# EAGLE schematic BLL-EBOOK-3506 (EAGLE 9.6.2)
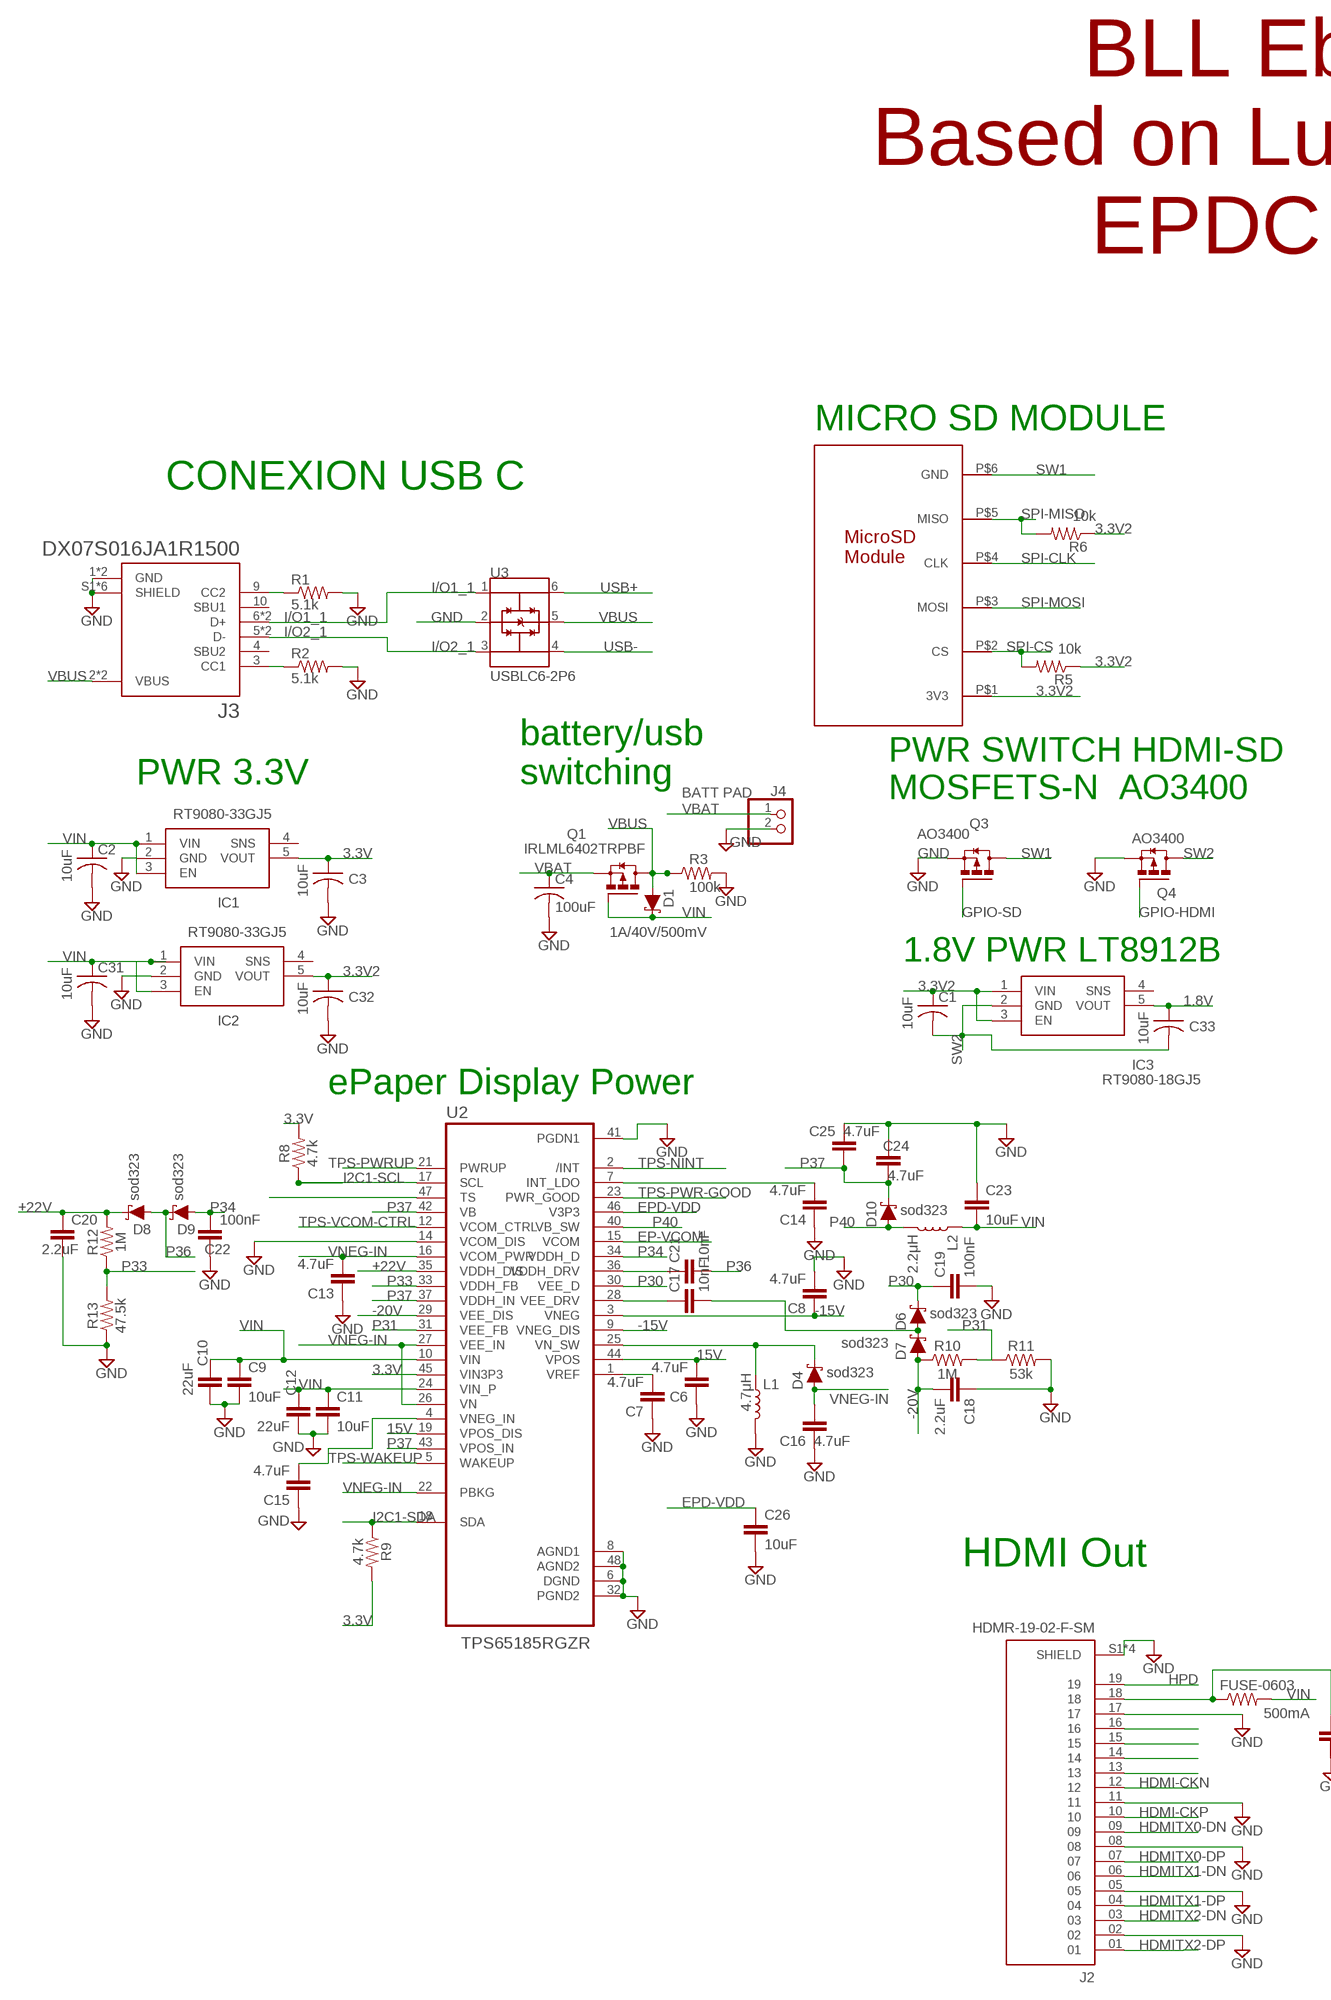
[diagram p0: schematic, sheet 1, part 1 of 2]
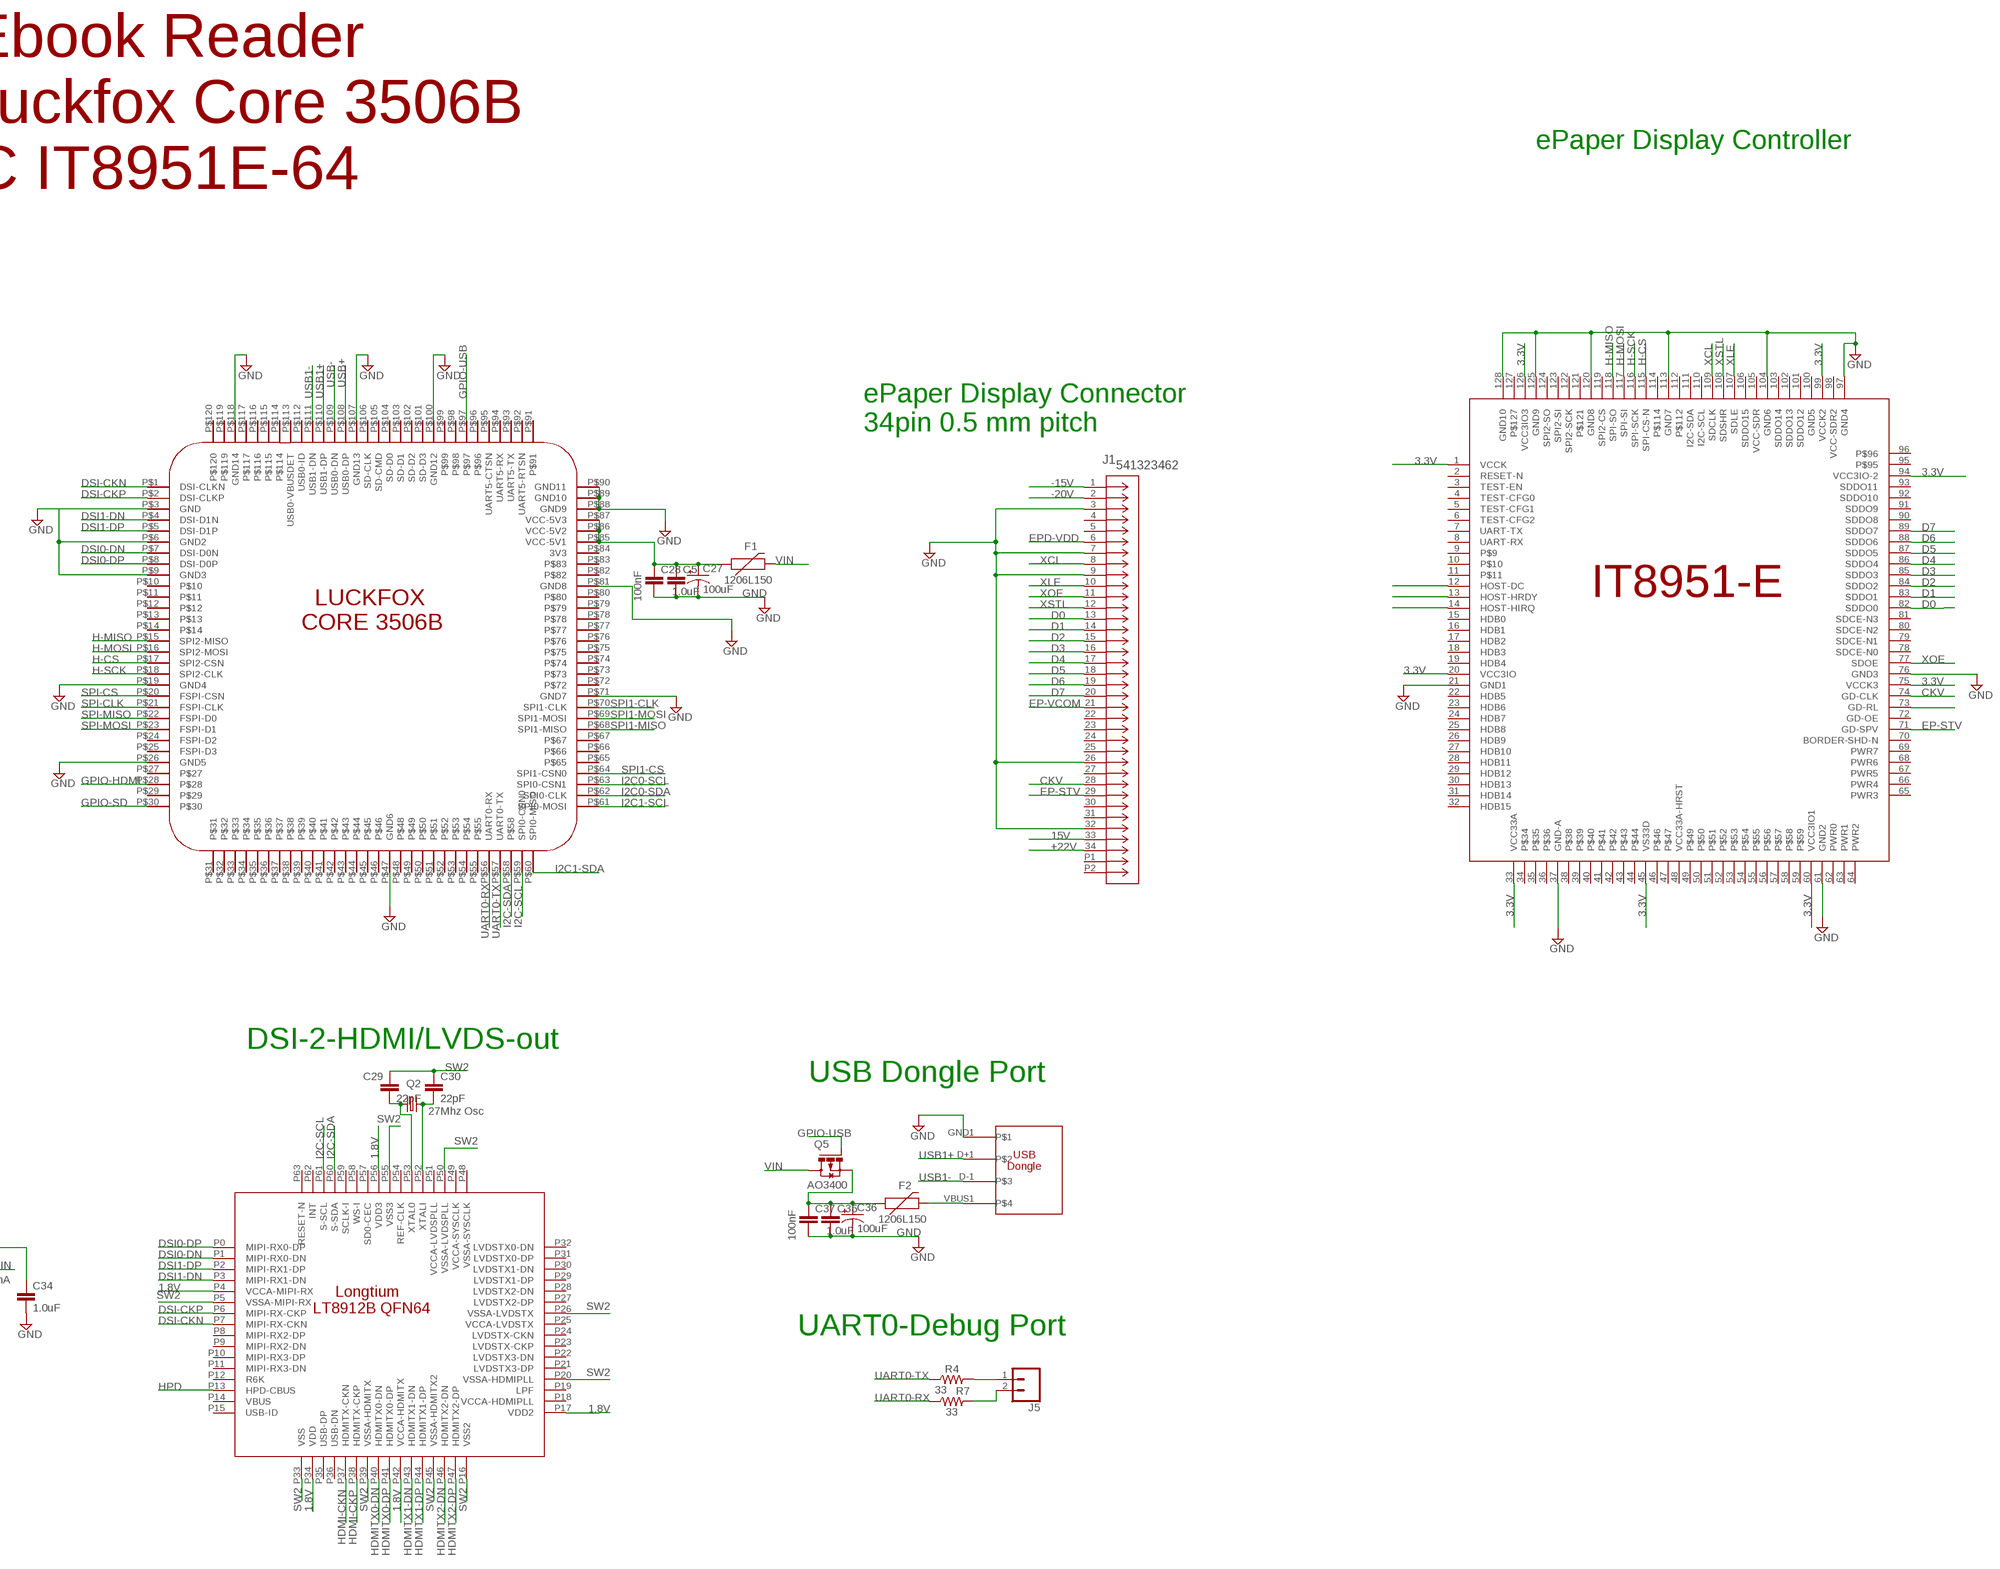
[diagram p1: schematic, sheet 1, part 2 of 2]

## Parts
C1  10uF  C-USC0603  [C0603]
C2  10uF  C-USC0603  [C0603]
C3  10uF  C-USC0603  [C0603]
C4  100uF  C-USC0603  [C0603]
C5  1.0uF  1.0UF-0603-16V-10%-X7R  [0603]
C6  4.7uF  4.7UF-0603-35V-(20%)  [0603]
C7  4.7uF  4.7UF-0603-35V-(20%)  [0603]
C8  4.7uF  4.7UF-0603-35V-(20%)  [0603]
C9  10uF  10UF-0805-10V-10%  [0805]
C10  22uF  22UF-0805-16V-20%  [0805]
C11  10uF  10UF-0805-10V-10%  [0805]
C12  22uF  22UF-0805-16V-20%  [0805]
C13  4.7uF  4.7UF-0603-35V-(20%)  [0603]
C14  4.7uF  4.7UF-0603-35V-(20%)  [0603]
C15  4.7uF  4.7UF-0603-35V-(20%)  [0603]
C16  4.7uF  4.7UF-0603-35V-(20%)  [0603]
C17  10nF  10NF-0603-50V-10%  [0603]
C18  2.2uF  2.2UF-1206-50V-10%  [1206]
C19  100nF  DNP-0603  [0603]
C20  2.2uF  2.2UF-1206-50V-10%  [1206]
C21  10nF  10NF-0603-50V-10%  [0603]
C22  100nF  DNP-0603  [0603]
C23  10uF  10UF-0805-10V-10%  [0805]
C24  4.7uF  4.7UF-0603-35V-(20%)  [0603]
C25  4.7uF  4.7UF-0603-35V-(20%)  [0603]
C26  10uF  10UF-0805-10V-10%  [0805]
C27  100uF  100UF-POLAR-EIA3528-10V-20%(TANT)  [EIA3528]
C28  100nF  CAP-0805  [0805]
C29  22pF  22PF-0603-50V-5%  [0603]
C30  22pF  22PF-0603-50V-5%  [0603]
C31  10uF  C-USC0603  [C0603]
C32  10uF  C-USC0603  [C0603]
C33  10uF  C-USC0603  [C0603]
C34  1.0uF  1.0UF-0603-16V-10%  [0603]
C35  1.0uF  1.0UF-0603-16V-10%-X7R  [0603]
C36  100uF  100UF-POLAR-EIA3528-10V-20%(TANT)  [EIA3528]
C37  100nF  CAP-0805  [0805]
D1  1A/40V/500mV  DIODE-SCHOTTKY-SS14  [SMA-DIODE]
D4  sod323  DIODE-SCHOTTKY-PMEG4005EJ  [SOD-323]
D6  sod323  DIODE-SCHOTTKY-PMEG4005EJ  [SOD-323]
D7  sod323  DIODE-SCHOTTKY-PMEG4005EJ  [SOD-323]
D8  sod323  DIODE-SCHOTTKY-PMEG4005EJ  [SOD-323]
D9  sod323  DIODE-SCHOTTKY-PMEG4005EJ  [SOD-323]
D10  sod323  DIODE-SCHOTTKY-PMEG4005EJ  [SOD-323]
F1  1206L150  PPTC_6V500MA-2  [1206]
F2  1206L150  PPTC_6V500MA-2  [1206]
FUSE-0603  500mA  1.8MOHM  [0603]
IC1  RT9080-33GJ5  [SOT94P280X100-5N]
IC2  RT9080-33GJ5  [SOT94P280X100-5N]
IC3  RT9080-18GJ5  RT9080-33GJ5  [SOT94P280X100-5N]
J1  541323462  [CON_541323462_MOL]
J2  HDMR-19-02-F-SM  [SAMTEC_HDMR-19-02-F-SM]
J3  DX07S016JA1R1500  [JAE_DX07S016JA1R1500]
J4  BATT PAD  PINHD-1X2/90  [1X02/90]
J5  CONN_02LOCK  [1X02_LOCK]
L1  4.7μH  4.7μH_SHIELDED_INDUCTOR  [1008(2520)]
L2  2.2μH  2.2μH_SHIELDED_INDUCTOR  [0806]
LT8912  LT8912B  [LT8912B]
Q1  IRLML6402TRPBF  [SOT23]
Q2  27Mhz Osc  KX-9B  [5.0X3.2_2]
Q3  AO3400  IRLML6402TRPBF  [SOT23]
Q4  AO3400  IRLML6402TRPBF  [SOT23]
Q5  AO3400  IRLML6402TRPBF  [SOT23]
R1  5.1k  R-US_M0805  [M0805]
R2  5.1k  R-US_M0805  [M0805]
R3  100k  R-US_R0603  [R0603]
R4  33  33OHM-0603-1/10W-1%  [0603]
R5  10k  R-US_M0805  [M0805]
R6  10k  R-US_M0805  [M0805]
R7  33  33OHM-0603-1/10W-1%  [0603]
R8  4.7k  4.7KOHM-0603-1/10W-1%  [0603]
R9  4.7k  4.7KOHM-0603-1/10W-1%  [0603]
R10  1M  1MOHM-0603-1/4W-5%  [0603]
R11  53k  RESISTOR0805  [0805]
R12  1M  1MOHM-0603-1/4W-5%  [0603]
R13  47.5k  RESISTOR0805  [0805]
U2  TPS65185RGZR  [QFN50P700X700X100-49N]
U3  USBLC6-2P6  [SOT50P160X60-6N]
U$1  IT8951  [LQFP128_STM]
U$3  LUCKFOX_CORE3506  [CORE3506]
U$4  MICROSD-MODULE  [MICROSD-MOD]
U$5  USB-WIFI-DONGLE  [USB-A-SMT-MALE]

## Nets
1.8V: C33.1 IC3.5(VOUT) LT8912.P4(VCCA-MIPI-RX) LT8912.P17(VDD2) LT8912.P34(VDD) LT8912.P42(VCCA-HDMITX) LT8912.P56(VDD3)
3.3V: C3.1 IC1.5(VOUT) R8.2 R9.2 U2.45(VIN3P3) U$1.1(VCCK) U$1.20(VCC3IO) U$1.33(VCC33A) U$1.45(VS33D) U$1.60(VCC3IO1) U$1.75(VCCK3) U$1.94(VCC3IO-2) U$1.99(VCCK2) U$1.126(VCC3IO3)
3.3V2: C1.1 C32.1 IC2.5(VOUT) IC3.1(VIN) IC3.3(EN) R5.1 R6.1 U$4.P$1(3V3)
15V: C6.2 J1.33 U2.19(VPOS_DIS) U2.44(VPOS)
+22V: C20.1 D8.C J1.34 R12.2 U2.35(VDDH_DIS)
-15V: C8.1 J1.1 U2.3(VNEG) U2.9(VNEG_DIS)
-20V: C18.2 D7.A J1.2 R10.1 U2.29(VEE_DIS)
CKV: J1.28 U$1.74(GD-CLK)
D0: J1.13 U$1.82(SDDO0)
D1: J1.14 U$1.83(SDDO1)
D2: J1.15 U$1.84(SDDO2)
D3: J1.16 U$1.85(SDDO3)
D4: J1.17 U$1.86(SDDO4)
D5: J1.18 U$1.87(SDDO5)
D6: J1.19 U$1.88(SDDO6)
D7: J1.20 U$1.89(SDDO7)
DSI0-DN: LT8912.P1(MIPI-RX0-DN) U$3.P$7(DSI-D0N)
DSI0-DP: LT8912.P0(MIPI-RX0-DP) U$3.P$8(DSI-D0P)
DSI1-DN: LT8912.P3(MIPI-RX1-DN) U$3.P$4(DSI-D1N)
DSI1-DP: LT8912.P2(MIPI-RX1-DP) U$3.P$5(DSI-D1P)
DSI-CKN: LT8912.P7(MIPI-RX-CKN) U$3.P$1(DSI-CLKN)
DSI-CKP: LT8912.P6(MIPI-RX-CKP) U$3.P$2(DSI-CLKP)
EP-STV: J1.29 U$1.71(GD-SPV)
EP-VCOM: J1.21 U2.15(VCOM)
EPD-VDD: C26.1 J1.6 U2.46(V3P3)
GND: C2.2 C3.2 C4.2 C5.2 C6.1 C7.1 C8.2 C9.2 C10.2 C11.2 C12.2 C13.1 C14.1 C15.1 C16.1 C18.1 C19.2 C20.2 C22.1 C23.1 C24.2 C25.2 C26.2 C27.C(-) C28.2 C31.2 C32.2 C34.2 C35.2 C36.C(-) C37.2 IC1.2(GND) IC2.2(GND) J1.3 J1.7 J1.9 J1.26 J1.32 J2.02 J2.05 J2.08 J2.11 J2.17 J2.S1(SHIELD) J2.S2(SHIELD) J2.S3(SHIELD) J2.S4(SHIELD) J3.1(GND) J3.12(GND) J3.S1(SHIELD) J3.S2(SHIELD) J3.S3(SHIELD) J3.S4(SHIELD) J3.S5(SHIELD) J3.S6(SHIELD) J4.2 L1.2 Q3.2(S) Q4.2(S) R1.2 R2.2 R3.2 R11.2 R13.1 U2.6(DGND) U2.8(AGND1) U2.14(VCOM_DIS) U2.32(PGND2) U2.41(PGDN1) U2.48(AGND2) U3.2(GND) U$1.21(GND1) U$1.37(GND-A) U$1.61(GND2) U$1.76(GND3) U$1.97(GND4) U$1.104(GND6) U$1.113(GND7) U$1.120(GND8) U$1.125(GND9) U$1.128(GND10) U$3.P$3(GND) U$3.P$6(GND2) U$3.P$9(GND3) U$3.P$19(GND4) U$3.P$26(GND5) U$3.P$47(GND6) U$3.P$71(GND7) U$3.P$81(GND8) U$3.P$88(GND9) U$3.P$89(GND10) U$3.P$90(GND11) U$3.P$100(GND12) U$3.P$107(GND13) U$3.P$118(GND14) U$5.GND1
GPIO-HDMI: Q4.1(G) U$3.P$28
GPIO-SD: Q3.1(G) U$3.P$30
GPIO-USB: Q5.1(G) U$3.P$97
H-CS: U$1.115(SPI-CS-N) U$3.P$17(SPI2-CSN)
H-MISO: U$1.118(SPI-SO) U$3.P$15(SPI2-MISO)
H-MOSI: U$1.117(SPI-SI) U$3.P$16(SPI2-MOSI)
H-SCK: U$1.116(SPI-SCK) U$3.P$18(SPI2-CLK)
HDMI-CKN: J2.12 LT8912.P37(HDMITX-CKN)
HDMI-CKP: J2.10 LT8912.P38(HDMITX-CKP)
HDMITX0-DN: J2.09 LT8912.P40(HDMITX0-DN)
HDMITX0-DP: J2.07 LT8912.P41(HDMITX0-DP)
HDMITX1-DN: J2.06 LT8912.P43(HDMITX1-DN)
HDMITX1-DP: J2.04 LT8912.P44(HDMITX1-DP)
HDMITX2-DN: J2.03 LT8912.P46(HDMITX2-DN)
HDMITX2-DP: J2.01 LT8912.P47(HDMITX2-DP)
HPD: J2.19 LT8912.P13(HPD-CBUS)
I2C0-SCL: U$3.P$63(SPI0-CSN1)
I2C0-SDA: U$3.P$62(SPI0-CLK)
I2C1-SCL: R8.1 U2.17(SCL) U$3.P$61(SPI0-MOSI)
I2C1-SDA: R9.1 U2.18(SDA) U$3.P$60(SPI0-MISO)
I2C-SCL: LT8912.P61(S-SCL) U$3.P$59(SPI0-CSN0)
I2C-SDA: LT8912.P60(S-SDA) U$3.P$58
I/O1_1: J3.6(D+) J3.7(D+) U3.1(I/O1_1)
I/O2_1: J3.5(D-) J3.8(D-) U3.3(I/O2_1)
N$1: C29.2 LT8912.P53(XTAL0) Q2.1
N$2: C30.2 LT8912.P52(XTALI) Q2.2
N$3: J3.3(CC1) R2.1
N$4: J3.9(CC2) R1.1
N$5: F2.2 U$5.VBUS1
N$6: J5.1 R4.2
N$7: U$1.73(GD-RL)
N$8: U$1.12(HOST-DC)
N$9: J5.2 R7.2
N$10: U$1.13(HOST-HRDY)
N$11: U2.47(TS)
N$12: C7.2 U2.1(VREF)
N$13: C15.2 U2.4(VNEG_IN)
N$14: C14.2 U2.7(INT_LDO)
N$15: D4.C L1.1 U2.25(VN_SW)
N$16: C17.1 U2.28(VEE_DRV)
N$17: C17.2 D6.A D7.C
N$19: C21.1 U2.36(VDDH_DRV)
N$22: U$1.14(HOST-HIRQ)
N$30: J2.13
N$31: J2.14
N$32: J2.15
N$33: J2.16
N$35: C34.1 FUSE-0603.1 J2.18
P: C5.1 C27.A(+) C28.1 F1.1 U$3.P$85(VCC-5V1) U$3.P$86(VCC-5V2) U$3.P$87(VCC-5V3)
P1: C35.1 C36.A(+) C37.1 F2.1 Q5.2(S)
P30: C19.1 D6.C U2.30(VEE_D)
P31: R10.2 R11.1 U2.31(VEE_FB)
P33: R12.1 R13.2 U2.33(VDDH_FB)
P34: C22.2 D9.A U2.34(VDDH_D)
P36: C21.2 D8.A D9.C
P37: C24.1 C25.1 D10.C U2.37(VDDH_IN) U2.42(VB) U2.43(VPOS_IN)
P40: D10.A L2.2 U2.40(VB_SW)
SPI1-CLK: U$3.P$70(SPI1-CLK)
SPI1-CS: U$3.P$64(SPI1-CSN0)
SPI1-MISO: U$3.P$68(SPI1-MISO)
SPI1-MOSI: U$3.P$69(SPI1-MOSI)
SPI-CLK: U$3.P$21(FSPI-CLK) U$4.P$4(CLK)
SPI-CS: R5.2 U$3.P$20(FSPI-CSN) U$4.P$2(CS)
SPI-MISO: R6.2 U$3.P$22(FSPI-D0) U$4.P$5(MISO)
SPI-MOSI: U$3.P$23(FSPI-D1) U$4.P$3(MOSI)
SW1: Q3.3(D) U$4.P$6(GND)
SW2: C1.2 C29.1 C30.1 C33.2 IC3.2(GND) LT8912.P5(VSSA-MIPI-RX) LT8912.P16(VSS2) LT8912.P20(VSSA-HDMIPLL) LT8912.P26(VSSA-LVDSTX) LT8912.P33(VSS) LT8912.P39(VSSA-HDMITX) LT8912.P45(VSSA-HDMITX2) LT8912.P50(VSSA-LVDSPLL) LT8912.P55(VSS3) Q4.3(D)
TPS-NINT: U2.2(/INT)
TPS-PWR-GOOD: U2.23(PWR_GOOD)
TPS-PWRUP: U2.21(PWRUP)
TPS-VCOM-CTRL: U2.12(VCOM_CTRL)
TPS-WAKEUP: U2.5(WAKEUP)
UART0-RX: R7.1 U$3.P$56(UART0-RX)
UART0-TX: R4.1 U$3.P$57(UART0-TX)
USB1+: U$3.P$110(USB1-DP) U$5.D+1
USB1-: U$3.P$111(USB1-DN) U$5.D-1
USB+: U3.6(I/O1_2) U$3.P$108(USB0-DP)
USB-: U3.4(I/O2_2) U$3.P$109(USB0-DN)
VBAT: C4.1 J4.1 Q1.2(S)
VBUS: D1.A J3.2(VBUS) J3.11(VBUS) Q1.3(D) R3.1 U3.5(VBUS)
VIN: C2.1 C9.1 C10.1 C11.1 C12.1 C23.2 C31.1 D1.C F1.2 FUSE-0603.2 IC1.1(VIN) IC1.3(EN) IC2.1(VIN) IC2.3(EN) L2.1 Q1.1(G) Q5.3(D) U2.10(VIN) U2.24(VIN_P)
VNEG-IN: C13.2 C16.2 D4.A U2.16(VCOM_PWR) U2.22(PBKG) U2.26(VN) U2.27(VEE_IN)
XCL: J1.8 U$1.109(SDCLK)
XLE: J1.10 U$1.107(SDLE)
XOE: J1.11 U$1.77(SDOE)
XSTL: J1.12 U$1.108(SDSHR)
Unconnected: IC1.4(SNS) IC2.4(SNS) IC3.4(SNS) J1.4 J1.5 J1.22 J1.23 J1.24 J1.25 J1.27 J1.30 J1.31 J1.P1 J1.P2 J3.4(SBU2) J3.10(SBU1) LT8912.P8(MIPI-RX2-DP) LT8912.P9(MIPI-RX2-DN) LT8912.P10(MIPI-RX3-DP) LT8912.P11(MIPI-RX3-DN) LT8912.P12(R6K) LT8912.P14(VBUS) LT8912.P15(USB-ID) LT8912.P18(VCCA-HDMIPLL) LT8912.P19(LPF) LT8912.P21(LVDSTX3-DP) LT8912.P22(LVDSTX3-DN) LT8912.P23(LVDSTX-CKP) LT8912.P24(LVDSTX-CKN) LT8912.P25(VCCA-LVDSTX) LT8912.P27(LVDSTX2-DP) LT8912.P28(LVDSTX2-DN) LT8912.P29(LVDSTX1-DP) LT8912.P30(LVDSTX1-DN) LT8912.P31(LVDSTX0-DP) LT8912.P32(LVDSTX0-DN) LT8912.P35(USB-DP) LT8912.P36(USB-DN) LT8912.P48(VSSA-SYSCLK) LT8912.P49(VCCA-SYSCLK) LT8912.P51(VCCA-LVDSPLL) LT8912.P54(REF-CLK) LT8912.P57(SD0-CEC) LT8912.P58(WS-I) LT8912.P59(SCLK-I) LT8912.P62(INT) LT8912.P63(RESET-N) U$1.2(RESET-N) U$1.3(TEST-EN) U$1.4(TEST-CFG0) U$1.5(TEST-CFG1) U$1.6(TEST-CFG2) U$1.7(UART-TX) U$1.8(UART-RX) U$1.9 U$1.10 U$1.11 U$1.15(HDB0) U$1.16(HDB1) U$1.17(HDB2) U$1.18(HDB3) U$1.19(HDB4) U$1.22(HDB5) U$1.23(HDB6) U$1.24(HDB7) U$1.25(HDB8) U$1.26(HDB9) U$1.27(HDB10) U$1.28(HDB11) U$1.29(HDB12) U$1.30(HDB13) U$1.31(HDB14) U$1.32(HDB15) U$1.34 U$1.35 U$1.36 U$1.38 U$1.39 U$1.40 U$1.41 U$1.42 U$1.43 U$1.44 U$1.46 U$1.47 U$1.48(VCC33A-HRST) U$1.49 U$1.50 U$1.51 U$1.52 U$1.53 U$1.54 U$1.55 U$1.56 U$1.57 U$1.58 U$1.59 U$1.62(PWR0) U$1.63(PWR1) U$1.64(PWR2) U$1.65(PWR3) U$1.66(PWR4) U$1.67(PWR5) U$1.68(PWR6) U$1.69(PWR7) U$1.70(BORDER-SHD-N) U$1.72(GD-OE) U$1.78(SDCE-N0) U$1.79(SDCE-N1) U$1.80(SDCE-N2) U$1.81(SDCE-N3) U$1.90(SDDO8) U$1.91(SDDO9) U$1.92(SDDO10) U$1.93(SDDO11) U$1.95 U$1.96 U$1.98(VCC-SDR2) U$1.100(GND5) U$1.101(SDDO12) U$1.102(SDDO13) U$1.103(SDDO14) U$1.105(VCC-SDR) U$1.106(SDDO15) U$1.110(I2C-SCL) U$1.111(I2C-SDA) U$1.112 U$1.114 U$1.119(SPI2-CS) U$1.121 U$1.122(SPI2-SCK) U$1.123(SPI2-SI) U$1.124(SPI2-SO) U$1.127 U$3.P$10 U$3.P$11 U$3.P$12 U$3.P$13 U$3.P$14 U$3.P$24(FSPI-D2) U$3.P$25(FSPI-D3) U$3.P$27 U$3.P$29 U$3.P$31 U$3.P$32 U$3.P$33 U$3.P$34 U$3.P$35 U$3.P$36 U$3.P$37 U$3.P$38 U$3.P$39 U$3.P$40 U$3.P$41 U$3.P$42 U$3.P$43 U$3.P$44 U$3.P$45 U$3.P$46 U$3.P$48 U$3.P$49 U$3.P$50 U$3.P$51 U$3.P$52 U$3.P$53 U$3.P$54 U$3.P$55 U$3.P$65 U$3.P$66 U$3.P$67 U$3.P$72 U$3.P$73 U$3.P$74 U$3.P$75 U$3.P$76 U$3.P$77 U$3.P$78 U$3.P$79 U$3.P$80 U$3.P$82 U$3.P$83 U$3.P$84(3V3) U$3.P$91 U$3.P$92(UART5-RTSN) U$3.P$93(UART5-TX) U$3.P$94(UART5-RX) U$3.P$95(UART5-CTSN) U$3.P$96 U$3.P$98 U$3.P$99 U$3.P$101(SD-D3) U$3.P$102(SD-D2) U$3.P$103(SD-D1) U$3.P$104(SD-D0) U$3.P$105(SD-CMD) U$3.P$106(SD-CLK) U$3.P$112(USB0-ID) U$3.P$113(USB0-VBUSDET) U$3.P$114 U$3.P$115 U$3.P$116 U$3.P$117 U$3.P$119 U$3.P$120

## Notes on the sheet
- ePaper Display Controller
- BLL Ebook Reader
  Based on Luckfox Core 3506B
  EPDC IT8951E-64
- MICRO SD MODULE
- CONEXION USB C
- ePaper Display Connector
  34pin 0.5 mm pitch
- PWR 3.3V
- battery/usb 
  switching
- PWR SWITCH HDMI-SD 
  MOSFETS-N  AO3400
- 1.8V PWR LT8912B
- ePaper Display Power
- DSI-2-HDMI/LVDS-out
- USB Dongle Port
- HDMI Out
- UART0-Debug Port

## Library data of the parts
C1-C4 C31-C33 = rcl:C-US: CAPACITOR, American symbol; SPICEPREFIX: C
C5 C35 = SparkFun-Capacitors:1.0UF: 1µF ceramic capacitors A capacitor is a passive two-terminal electrical component used to store electrical energy temporarily in an electric field.; PROD_ID: CAP-13930
C6-C8 C13-C16 C24 C25 = SparkFun-Capacitors:4.7UF: 4.7µF ceramic capacitors A capacitor is a passive two-terminal electrical component used to store electrical energy temporarily in an electric field.; PROD_ID: CAP-14106
C9 C11 C23 C26 = SparkFun-Capacitors:10UF: 10.0µF ceramic capacitors A capacitor is a passive two-terminal electrical component used to store electrical energy temporarily in an electric field.; PROD_ID: CAP-11330
C10 C12 = SparkFun-Capacitors:22UF: 22µF ceramic capacitors A capacitor is a passive two-terminal electrical component used to store electrical energy temporarily in an electric field.; PROD_ID: CAP-14260
C17 C21 = SparkFun-Capacitors:10NF: 0.01uF/10nF/10,000pF ceramic capacitors A capacitor is a passive two-terminal electrical component used to store electrical energy temporarily in an electric field. CAP-09321; PROD_ID: CAP-00867
C18 C20 = SparkFun-Capacitors:2.2UF: 2.2µF ceramic capacitors A capacitor is a passive two-terminal electrical component used to store electrical energy temporarily in an electric field.; PROD_ID: CAP-10009
C19 C22 = SparkFun-Capacitors:DNP: Do-Not-Populate capacitor; VALUE: DNP
C27 C36 = SparkFun-Capacitors:100UF-POLAR: 100µF polarized capacitors A capacitor is a passive two-terminal electrical component used to store electrical energy temporarily in an electric field.; PROD_ID: CAP-16823
C28 C37 = SparkFun-Capacitors:CAP
C29 C30 = SparkFun-Capacitors:22PF: 22pF ceramic capacitors A capacitor is a passive two-terminal electrical component used to store electrical energy temporarily in an electric field.; PROD_ID: CAP-07876
C34 = SparkFun-Capacitors:1.0UF: 1µF ceramic capacitors A capacitor is a passive two-terminal electrical component used to store electrical energy temporarily in an electric field.; PROD_ID: CAP-00868
D1 = SparkFun-DiscreteSemi:DIODE-SCHOTTKY: Schottky diode A Schottky diode is a semiconductor diode which has a low forward voltage drop and a very fast switching action.; PROD_ID: DIO-08053
D4 D6-D10 = SparkFun-DiscreteSemi:DIODE-SCHOTTKY: Schottky diode A Schottky diode is a semiconductor diode which has a low forward voltage drop and a very fast switching action.; PROD_ID: DIO-10955; VALUE: 0.5A/40V/420mV
F1 F2 = SparkFun-Fuses:PPTC: Resettable Fuse PPTC Resettable Fuse. Really a sort of resistor with a polymeric positive temperature coefficient whose resistance increases dramatically with an increase in temperature. When heated by the power passing through the resistance rises causing the current to be limited, protecting the circuit. This is achieved by the transition of the polymer from a crystalline to an amorphous state where the conductive carbon separates breaking the conductive pathways found in the cool crystalline structure. When a PPTC cools back down it resumes conducting letting the circuit turn back on. SparkFun Products: SparkFun RedBoard - Programmed with Arduino <https://www.sparkfun.com/products/12757> Pro Micro - 5V/16MHz <https://www.sparkfun.com/products/12640> Arduino Pro 328 - 5V/16MHz <https://www.sparkfun.com/products/10915> MP3 Trigger <https://www.sparkfun.com/products/13720>; PROD_ID: RES-08585; VALUE: 6V/0.5A
FUSE-0603 = SparkFun-Resistors:1.8MOHM: 1.8 MOhms ±5% 0.1W, 1/10W Chip Resistor 0603; PROD_ID: RES-13994; VALUE: 1.8M
IC1-IC3 = RT9080-33GJ5:RT9080-33GJ5: Check availability <https://pricing.snapeda.com/parts/RT9080-33GJ5/Richtek%20USA/view-part?ref=eda>; AVAILABILITY: In Stock; CHECK_PRICES: https://www.snapeda.com/parts/RT9080-33GJ5/Richtek/view-part/?ref=eda; DESCRIPTION: Linear Voltage Regulator IC Positive Fixed 1 Output 600mA TSOT-23-5; MF: Richtek USA; MP: RT9080-33GJ5; PACKAGE: TSOT-23 Richtek; PRICE: None; SNAPEDA_LINK: https://www.snapeda.com/parts/RT9080-33GJ5/Richtek/view-part/?ref=snap
J1 = molex fpc 34p 0.5mm :541323462: Check availability <https://pricing.snapeda.com/parts/541323462/Molex/view-part?ref=eda>; AVAILABILITY: In Stock; CHECK_PRICES: https://www.snapeda.com/parts/541323462/Molex/view-part/?ref=eda; DESCRIPTION: 34 Position FFC, FPC Connector Contacts, Bottom 0.020 (0.50mm) Surface Mount, Right Angle; MF: Molex; MP: 541323462; PACKAGE: None; PRICE: None; SNAPEDA_LINK: https://www.snapeda.com/parts/541323462/Molex/view-part/?ref=snap
J2 = HDMR-19-02-F-SM:HDMR-19-02-F-SM: Check availability <https://pricing.snapeda.com/parts/HDMR-19-02-F-SM-TR/Samtec/view-part?ref=eda>; AVAILABILITY: In Stock; CHECK_PRICES: https://www.snapeda.com/parts/HDMR-19-02-F-SM-TR/Samtec/view-part/?ref=eda; DESCRIPTION: HDMI Receptacle Connector 19 Position Surface Mount, Right Angle; MF: Samtec; MP: HDMR-19-02-F-SM-TR; PACKAGE: None; PRICE: None; SNAPEDA_LINK: https://www.snapeda.com/parts/HDMR-19-02-F-SM-TR/Samtec/view-part/?ref=snap
J3 = DX07S016JA1R1500- usb c:DX07S016JA1R1500: Check availability <https://pricing.snapeda.com/parts/DX07S016JA1R1500/JAE%20Electronics/view-part?ref=eda>; AVAILABILITY: In Stock; CHECK_PRICES: https://www.snapeda.com/parts/DX07S016JA1R1500/JAE+Electronics/view-part/?ref=eda; DESCRIPTION: USB-C (USB TYPE-C) USB 2.0 Receptacle Connector 24 (16+8 Dummy) Position Surface Mount, Right Angle; Through Hole; MF: JAE Electronics; MP: DX07S016JA1R1500; PACKAGE: None; PRICE: None; SNAPEDA_LINK: https://www.snapeda.com/parts/DX07S016JA1R1500/JAE+Electronics/view-part/?ref=snap
J4 = pinhead:PINHD-1X2: PIN HEADER
J5 = SparkFun-Connectors:CONN_02: Multi connection point. Often used as Generic Header-pin footprint for 0.1 inch spaced/style header connections On any of the 0.1 inch spaced packages, you can populate with these: Break Away Headers - Straight <https://www.sparkfun.com/products/116> (PRT-00116) Break Away Male Headers - Right Angle <https://www.sparkfun.com/products/553> (PRT-00553) Female Headers <https://www.sparkfun.com/products/115> (PRT-00115) Break Away Headers - Machine Pin <https://www.sparkfun.com/products/117> (PRT-00117) Break Away Female Headers - Swiss Machine Pin <https://www.sparkfun.com/products/743> (PRT-00743) For SCREWTERMINALS and SPRING TERMINALS visit here: Screw Terimnals on SparkFun.com <https://www.sparkfun.com/search/results?term=Screw+Terminals> (5mm/3.5mm/2.54mm spacing) This device is also useful as a general connection point to wire up your design to another part of your project. Our various solder wires solder well into these plated through hole pads. Hook-Up Wire - Assortment (Stranded, 22 AWG) <https://www.sparkfun.com/products/11375> (PRT-11375) Hook-Up Wire - Assortment (Solid Core, 22 AWG) <https://www.sparkfun.com/products/11367> (PRT-11367) View the entire wire category on our website here <https://www.sparkfun.com/categories/141> Special notes: Molex polarized connector foot print use with: PRT-08233 with associated crimp pins and housings. 2.54_SCREWTERM for use with PRT-10571. 3.5mm Screw Terminal footprints for PRT-08084 5mm Screw Terminal footprints for use with PRT-08432
L1 = SparkFun-Coils:4.7μH_SHIELDED_INDUCTOR: 4.7uH Inductor 4.7uH 1.4A 50mOhm 1008(2520) Package Shielded; PROD_ID: NDUC-14880
L2 = SparkFun-Coils:2.2μH_SHIELDED_INDUCTOR: Murata 2.2uH Inductor 2.2uH 1.2A 110mOhm 0806 Package Shielded Bourns 2.2uH Inductor 2.2uH 5.5A 205mOhm 5x5mm Package Shielded; PROD_ID: NDUC-14257
LT8912 = LT8912B:LT8912B: The Lontium LT8912 MIPI® DSI to LVDS and HDMI/MHL bridge features a single-channel MIPI® D-PHY receiver front-end configuration with 4 data lanes per channel operating at 1.5Gbps per data lane and a maximum input bandwidth of 6Gbps. For screen application, the bridge decodes MIPI® DSI 18bpp RGB666 and 24bpp RGB888 packets and converts the formatted video data stream to a compatible LVDS output operating at pixel clock operating from 25MHz to 154MHz, offering a single-link LVDS with 4 data lanes per link.
Q1 Q3-Q5 = IRLML6402:IRLML6402: Check availability <https://pricing.snapeda.com/parts/IRLML6402/Infineon%20Technologies/view-part?ref=eda>; AVAILABILITY: In Stock; CHECK_PRICES: https://www.snapeda.com/parts/IRLML6402/Infineon/view-part/?ref=eda; DESCRIPTION: P-Channel 20 V 3.7A (Ta) 1.3W (Ta) Surface Mount Micro3â„¢ /SOT-23; MF: Infineon Technologies; MP: IRLML6402; PACKAGE: SOT-23-3 ON Semiconductor; PRICE: None; SNAPEDA_LINK: https://www.snapeda.com/parts/IRLML6402/Infineon/view-part/?ref=snap
Q2 = crystal-geyer_V1_0:KX: Quartz Crystals (MHz) SMD: KX - Serie Model Size l/w/h [mm] Frequency Range Frequency Stability Temp. Range [°C] Load Capacitance AECQ 200 availabel Datasheet KX-4 KX-5 KX-6 KX-7 KX-9A KX-9B KX-12A KX-12B KX-13 KX-20 KX-K KX-KS 1.6/1.2/0.3 2.0/1.6/0.45 2.5/2.0/0.55 3.2/2.5/0.8 5.0/3.2/1.0 5.0/3.2/1.1 6.0/3.5/1.1 6.0/3.5/1.0 7.0/5.0 /1.3 11.6/5.5/1.6 12.3/4.5/4.2 12.3/4.5/3.2 24.0 ~ 80.0 MHz 16.0 ~ 80.0 MHz 12.0 ~ 80.0 MHz 8.0 ~ 60.0 MHz 7,68 ~ 300,0 MHz 8,0 ~ 50,0 MHz 8,0 ~ 150,0 MHz 8,0 ~ 50,0 MHz 6,0 ~ 160,0 MHz 3,579 ~ 25,0 MHz 3,579 ~ 70,0 MHz 3,579 ~ 70,0 MHz ±10 … ±50ppm ±10 … ±50ppm ±10 … ±50ppm ±10 … ±50ppm ±10 … ±50ppm ±10 … ±50ppm ±10 … ±50ppm ±10 … ±50ppm ±10 … ±50ppm ±50ppm ±10 … ±50ppm ±10 … ±50ppm (*) -40°C …+85°C (*) -40°C …+125°C (*) -40°C …+125°C (*) -40°C …+125°C (*) -40°C …+105°C (*) -40°C …+105°C (*) -40°C …+125°C (*) -40°C …+105°C (*) -40°C …+105°C (*) -40°C …+105°C (*) -40°C …+85°C (*) -40°C …+85°C 8, 8…16 8, 8…16 10, 8…16 12, 7…20 16, 10…20 16, 10…20 16, 10…20 16, 12…20 16, 12…20 16, 12…20 16, 12…30 16, 12…30 - yes yes yes - - - - - - - - KX-4.pdf <http://www.geyer-electronic.de/uploads/tx_userartikelfrequenz/GEYER-KX-4.pdf> KX-5.pdf <http://www.geyer-electronic.de/uploads/tx_userartikelfrequenz/GEYER-KX-5.pdf> KX-6.pdf <http://www.geyer-electronic.de/uploads/tx_userartikelfrequenz/GEYER-KX-6.pdf> KX-7.pdf <http://www.geyer-electronic.de/uploads/tx_userartikelfrequenz/GEYER-KX-7.pdf> KX-9A.pdf <http://www.geyer-electronic.de/uploads/tx_userartikelfrequenz/GEYER-KX-9A.pdf> KX-9B.pdf <http://www.geyer-electronic.de/uploads/tx_userartikelfrequenz/GEYER-KX-9B.pdf> KX-12A.pdf <http://www.geyer-electronic.de/uploads/tx_userartikelfrequenz/GEYER-KX-12A.pdf> KX-12B.pdf <http://www.geyer-electronic.de/uploads/tx_userartikelfrequenz/GEYER-KX-12B.pdf> KX-13.pdf <http://www.geyer-electronic.de/uploads/tx_userartikelfrequenz/GEYER-KX-13.pdf> KX-20.pdf <http://www.geyer-electronic.de/uploads/tx_userartikelfrequenz/GEYER-KX-20.pdf> KX-K.pdf <http://www.geyer-electronic.de/uploads/tx_userartikelfrequenz/GEYER-KX-K.pdf> KX-KS.pdf <http://www.geyer-electronic.de/uploads/tx_userartikelfrequenz/GEYER-KX-KS.pdf> <http://www.geyer-electronic.de/fileadmin/template/img/logo-geyer-electronic.png> Details see: http://www.geyer-electronic.de/Frequenz-Produkte.9.0.html Created 2016-06-07, Hans Locher 2016 (C) Geyer Quartz Technology KX4,KX5,KX6,KX7,KX9A,KX9B,KX12A,KX12B,KX13,KX20,KXK,KXKS;1612;2016;2520;3225;5032;6035;7050;11655;12345;1,6x1,2;2,0x1,6;2,5x2,0;3,2x2,5;5,0x3,2;6,0x3,5;7,0x5,0;11,6x5,5;12,3x4,5;12,3x4,5;1.6x1.2;2.0x1.6;2.5x2.0;3.2x2.5;5.0x3.2;6.0x3.5;7.0x5.0;11.6x5.5;12.3x4.5;12.3x4.5;
R1-R3 R5 R6 = rcl:R-US_: RESISTOR, American symbol; SPICEPREFIX: R
R4 R7 = SparkFun-Resistors:33OHM: 33Ω resistor A resistor is a passive two-terminal electrical component that implements electrical resistance as a circuit element. Resistors act to reduce current flow, and, at the same time, act to lower voltage levels within circuits. - Wikipedia; PROD_ID: RES-08270
R8 R9 = SparkFun-Resistors:4.7KOHM: 4.7kΩ resistor A resistor is a passive two-terminal electrical component that implements electrical resistance as a circuit element. Resistors act to reduce current flow, and, at the same time, act to lower voltage levels within circuits. - Wikipedia; PROD_ID: RES-07857
R10 R12 = SparkFun-Resistors:1MOHM: 1MΩ resistor A resistor is a passive two-terminal electrical component that implements electrical resistance as a circuit element. Resistors act to reduce current flow, and, at the same time, act to lower voltage levels within circuits. - Wikipedia; PROD_ID: RES-07868
R11 R13 = SparkFun-Resistors:RESISTOR: Generic Resistor Package
U2 = TPS65185RGZR:TPS65185RGZR: Check availability <https://pricing.snapeda.com/parts/TPS65185RGZR/Texas%20Instruments/view-part?ref=eda>; AVAILABILITY: In Stock; CHECK_PRICES: https://www.snapeda.com/parts/TPS65185RGZR/Texas+Instruments/view-part/?ref=eda; DESCRIPTION: PMIC for E-Ink® Vizplex™ Enabled Electronic Paper Display w/ Active Discharge; MF: Texas Instruments; MP: TPS65185RGZR; PACKAGE: VQFN-48 Texas Instruments; PRICE: None; SNAPEDA_LINK: https://www.snapeda.com/parts/TPS65185RGZR/Texas+Instruments/view-part/?ref=snap
U3 = USBLC6-2P6:USBLC6-2P6: Check availability <https://pricing.snapeda.com/parts/USBLC6-2P6/STMicroelectronics/view-part?ref=eda>; AVAILABILITY: In Stock; CHECK_PRICES: https://www.snapeda.com/parts/USBLC6-2P6/STMicroelectronics/view-part/?ref=eda; DESCRIPTION: 17V Clamp 5A (8/20µs) Ipp Tvs Diode Surface Mount SOT-666; MF: STMicroelectronics; MP: USBLC6-2P6; PACKAGE: SOT-666 STMicroelectronics; PRICE: None; SNAPEDA_LINK: https://www.snapeda.com/parts/USBLC6-2P6/STMicroelectronics/view-part/?ref=snap
U$1 = it8951E:IT8951: Controlador de alto rendimiento y bajo costo para EPDs (Electronic Paper Displays) con soporte para VCOM AC/DC. Integra funciones como auto-display al arranque, alpha blending y picture-in-picture para reducir la carga del host. Compatible con resoluciones flexibles hasta 2048×2048 y equipado con 32/64 Mb de SDRAM interna. Interfaces disponibles: SPI, I²C, USB, Intel 80 y Motorola 68. Ideal para aplicaciones embebidas con pantallas e-paper monocromáticas o en escala de grises
U$3 = Luckfox_Core3506:LUCKFOX_CORE3506: Módulo SOM compacto de 32 mm × 32 mm basado en el chip Rockchip RK3506B. Incluye procesador de cuatro núcleos (3× Cortex-A7 + 1× Cortex-M0), 512 MB de RAM DDR3L externa y almacenamiento eMMC de 8 GB. Ofrece 120 pines tipo stamp hole con múltiples interfaces (SPI, I2C, UART, USB, GPIO, SDIO), ideal para sistemas embebidos de bajo consumo. Compatible con expansión externa vía USB y adaptable a proyectos personalizados como lectores E-Ink, interfaces gráficas simples o dispositivos portátiles. Requiere placa base para su funcionamiento. No incluye WiFi integrado, pero puede añadirse mediante dongle USB o usando la versión Lyra W.
U$4 = micro-sd-module:MICROSD-MODULE
U$5 = usb-wifi-dongle:USB-WIFI-DONGLE: Esta es una libreria personalizada para la implementacion de un modulo usb bien sea wifi, o combo wifi-bluetooth, o de cualquier otro proposito que cumpla con el estandar USB 2.0. Las lineas expuestas corresponden a los trazos de un puerto usb tipo A. aunque el modulo tiene una zona referente a la zona de la antena, es importante resaltar que la zona de la antena debe quedar expuesta al aire sin ninguna obstruccion o tener contacto con el pcb para un mayor desempeño.